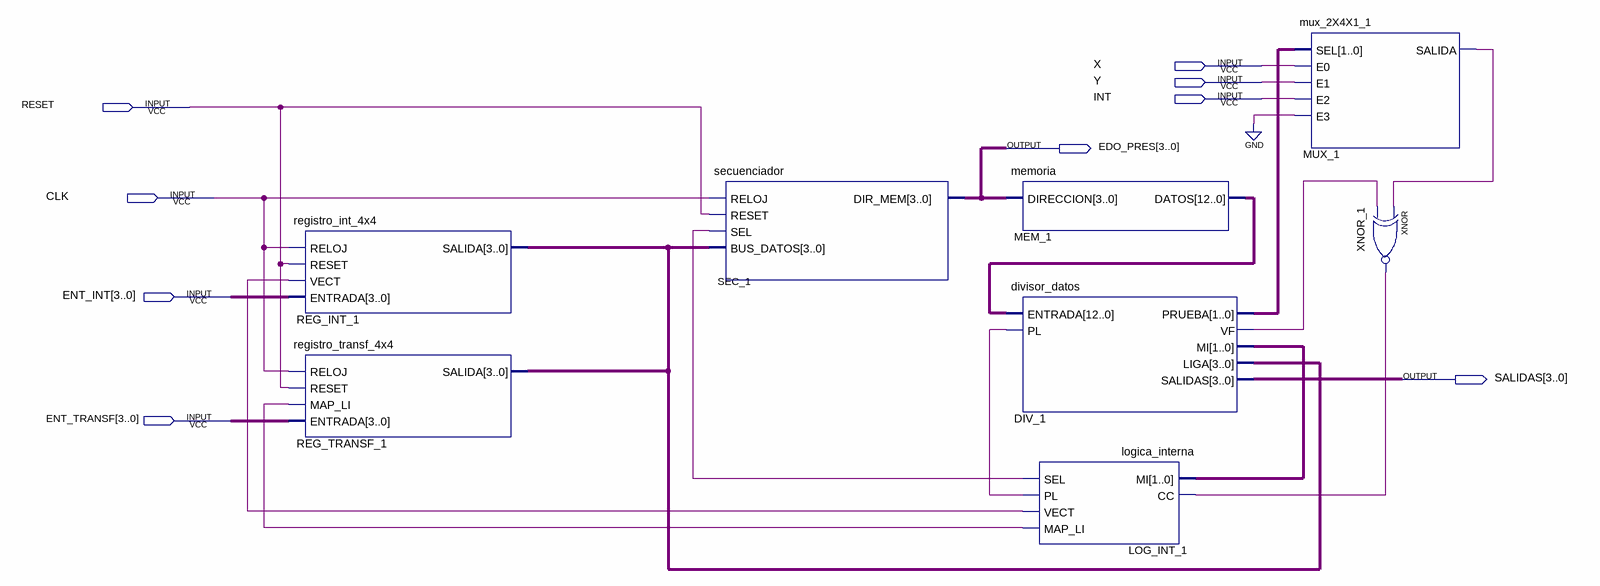
[diagram p0: schematic sheet]
// Quartus schematic practica6.bdf as structural Verilog: 8 symbols, 9 pins
module practica6 (
  input  X,
  input  Y,
  input  INT,
  input  RESET,
  input  CLK,
  input  [3:0] ENT_INT,
  input  [3:0] ENT_TRANSF,
  output [3:0] EDO_PRES,
  output [3:0] SALIDAS
);

  wire DIV_1_vf, LOG_INT_1_map_li, LOG_INT_1_pl, LOG_INT_1_sel, LOG_INT_1_vect, MUX_1_salida, XNOR_1_out;
  wire [1:0] DIV_1_mi, DIV_1_prueba;
  wire [3:0] REG_INT_1_salida;
  wire [12:0] MEM_1_datos;

  registro_int_4x4 REG_INT_1 (
    .RELOJ(CLK), .RESET(RESET), .VECT(LOG_INT_1_vect), .ENTRADA(ENT_INT), .SALIDA(REG_INT_1_salida));
  registro_transf_4x4 REG_TRANSF_1 (
    .RELOJ(CLK), .RESET(RESET), .MAP_LI(LOG_INT_1_map_li), .ENTRADA(ENT_TRANSF), .SALIDA(REG_INT_1_salida));
  secuenciador SEC_1 (
    .RELOJ(CLK), .RESET(RESET), .SEL(LOG_INT_1_sel), .BUS_DATOS(REG_INT_1_salida), .DIR_MEM(EDO_PRES));
  memoria MEM_1 (.DIRECCION(EDO_PRES), .DATOS(MEM_1_datos));
  divisor_datos DIV_1 (
    .ENTRADA(MEM_1_datos), .PL(LOG_INT_1_pl), .PRUEBA(DIV_1_prueba), .VF(DIV_1_vf), .MI(DIV_1_mi),
    .LIGA(REG_INT_1_salida), .SALIDAS(SALIDAS));
  logica_interna LOG_INT_1 (
    .MI(DIV_1_mi), .CC(XNOR_1_out), .SEL(LOG_INT_1_sel), .PL(LOG_INT_1_pl), .VECT(LOG_INT_1_vect),
    .MAP_LI(LOG_INT_1_map_li));
  mux_2X4X1_1 MUX_1 (.SEL(DIV_1_prueba), .E0(X), .E1(Y), .E2(INT), .E3(1'b0), .SALIDA(MUX_1_salida));
  xnor XNOR_1 (XNOR_1_out, MUX_1_salida, DIV_1_vf);
endmodule
